# EasyEDA schematic Top.json
TITLE: Sheet_2; REV: 1.0; Date: 2026-09-05; Sheet: 1/1; Company: Your Company
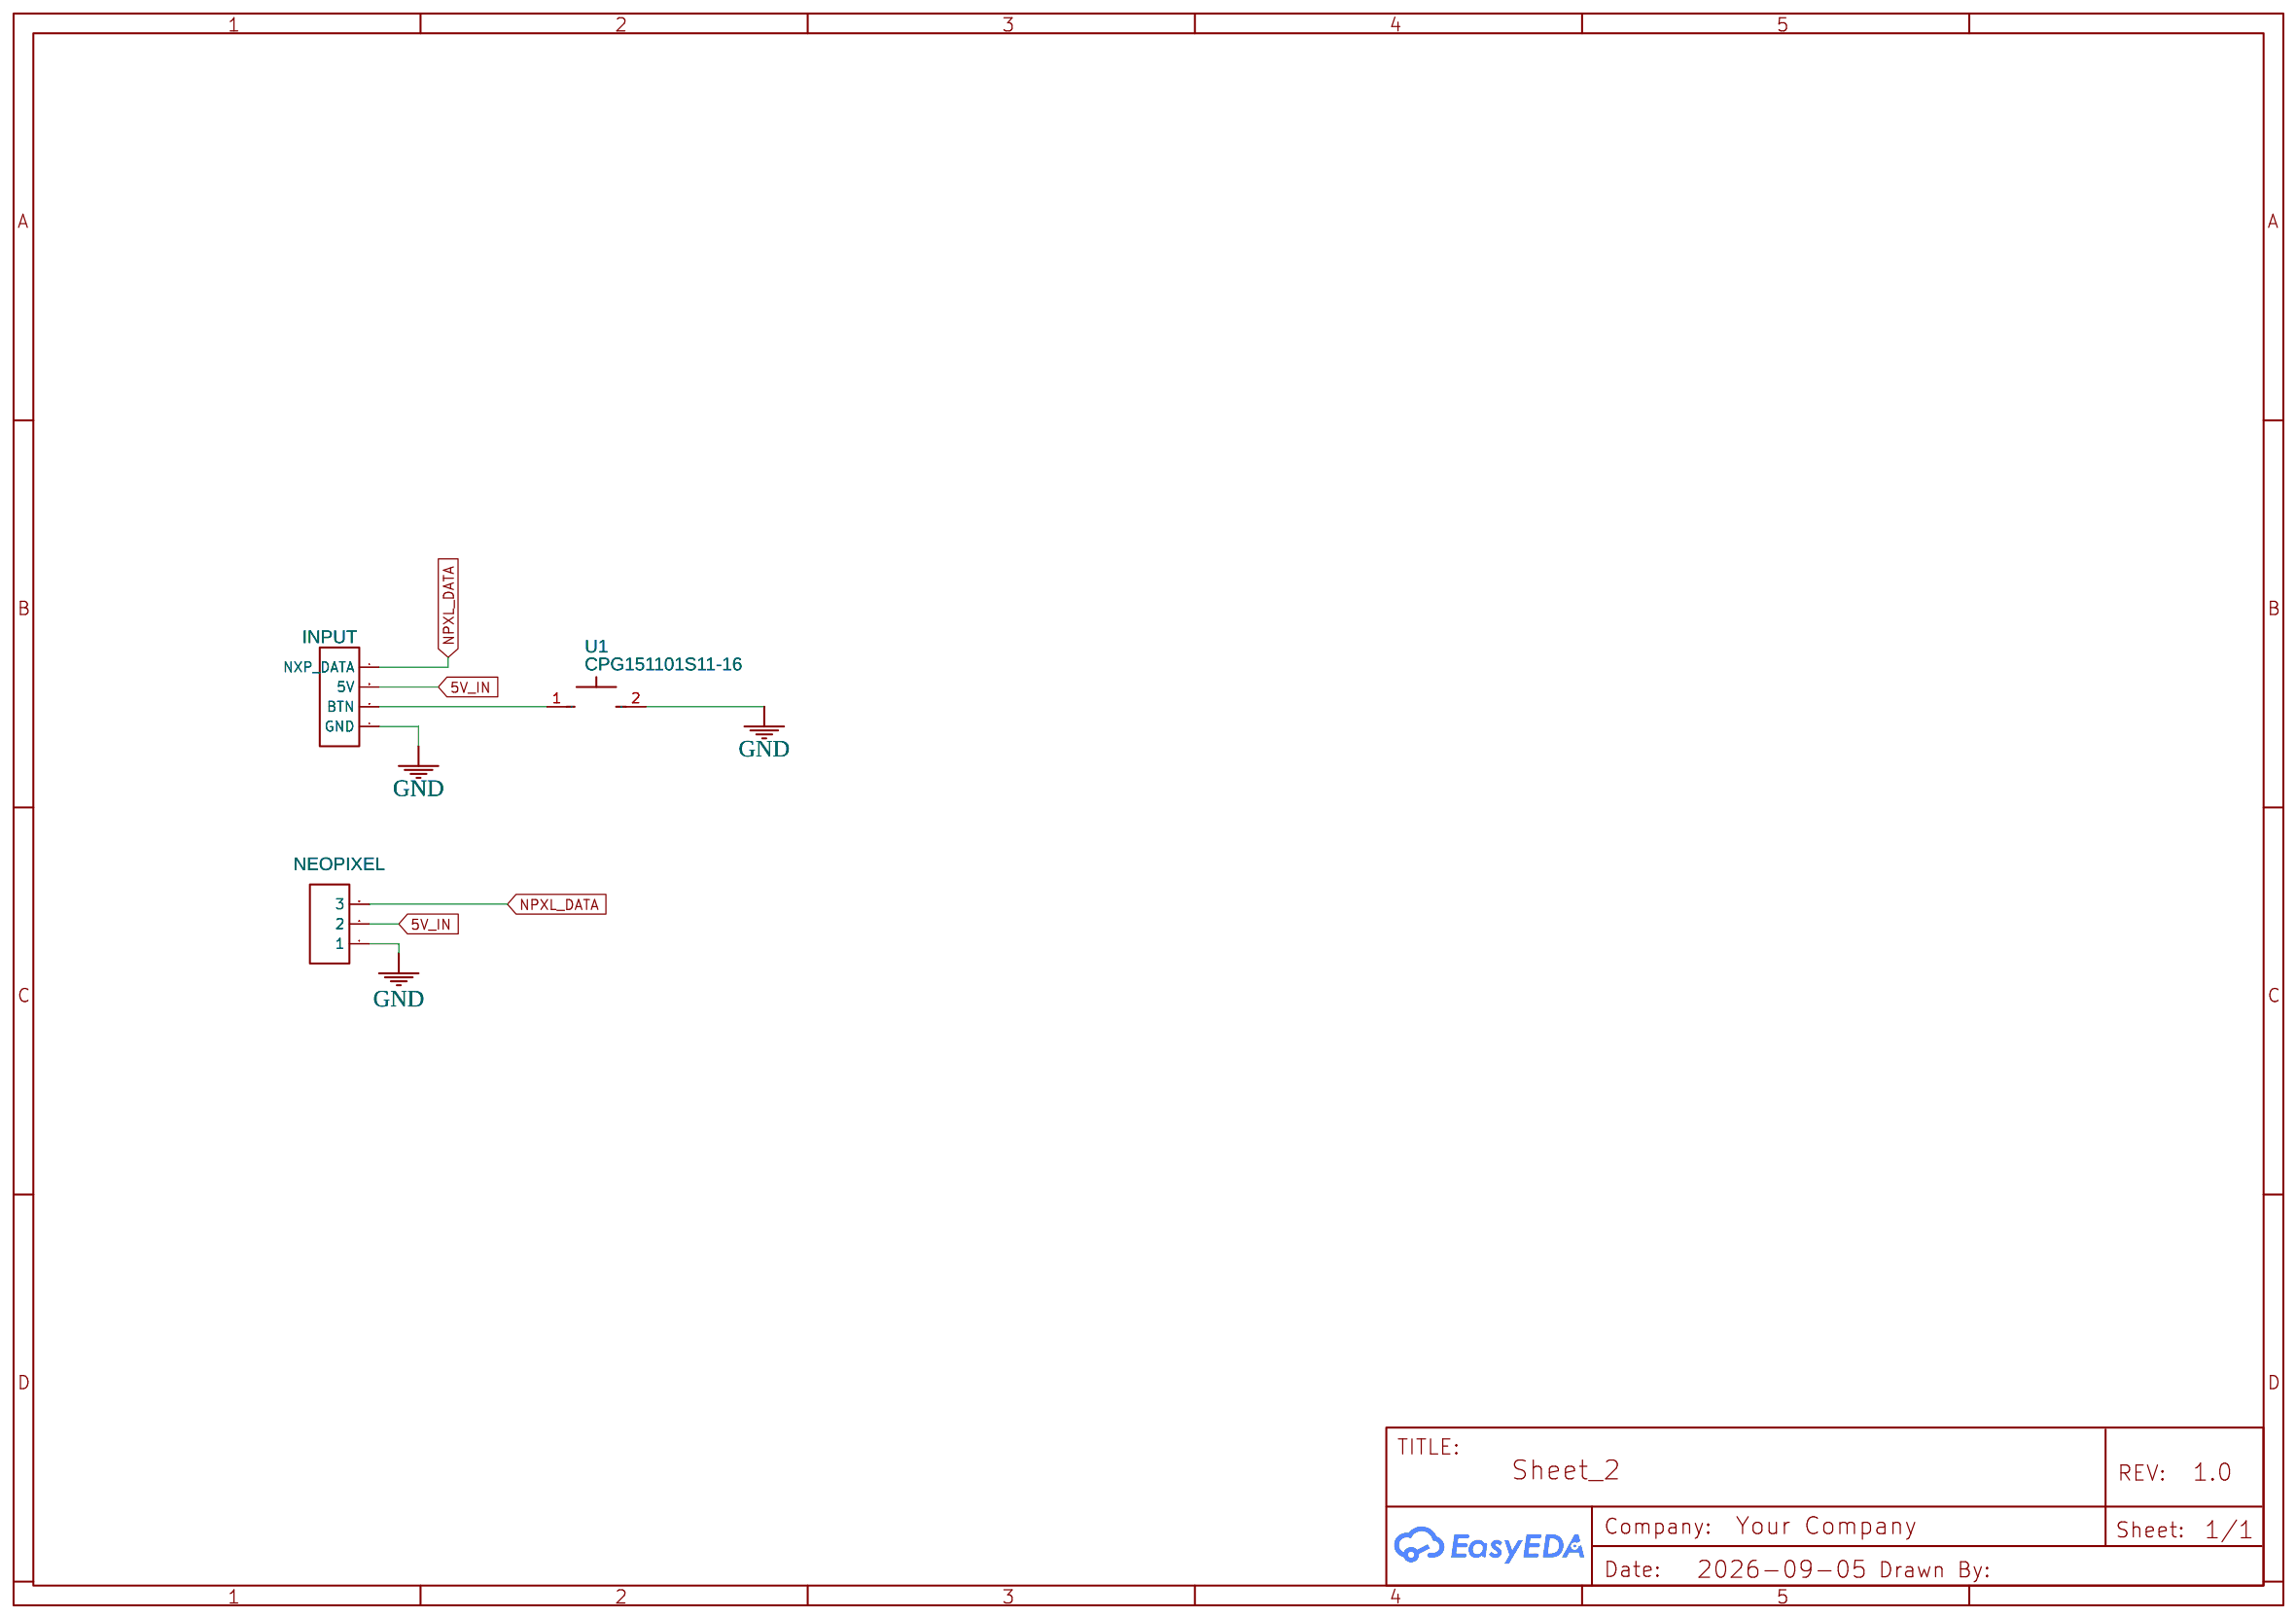
[diagram p0: schematic sheet]

## Parts
INPUT  output  [HDR-F-2.54_1X4]
NEOPIXEL  NEOPIXEL  [HDR-F-2.54_1X3]
U1  CPG151101S11-16  [SMD_KEYBOARD-SW]

## Library data of the parts
INPUT = HDR-F-2.54_1x4: Supplier Part: C225501; Supplier: LCSC; Contributor: LCEDA_Lib
NEOPIXEL = HDR-F-2.54_1x3: Supplier Part: C146690; Supplier: LCSC; Contributor: LCEDA_Lib
U1 = CPG151101S11-16: Contributor: lcsc; Supplier: LCSC; Supplier Part: C5156480; Manufacturer: Kailh(凯华); JLCPCB Part Class: Extended Part

## Nets
5V_IN: INPUT.3(5V) NEOPIXEL.2
GND: INPUT.1(GND) NEOPIXEL.1 U1.2
NPXL_DATA: INPUT.4(NXP_DATA) NEOPIXEL.3
Net-(INPUT-2): INPUT.2(BTN) U1.1
